# Altium project Board 2.PrjPcb
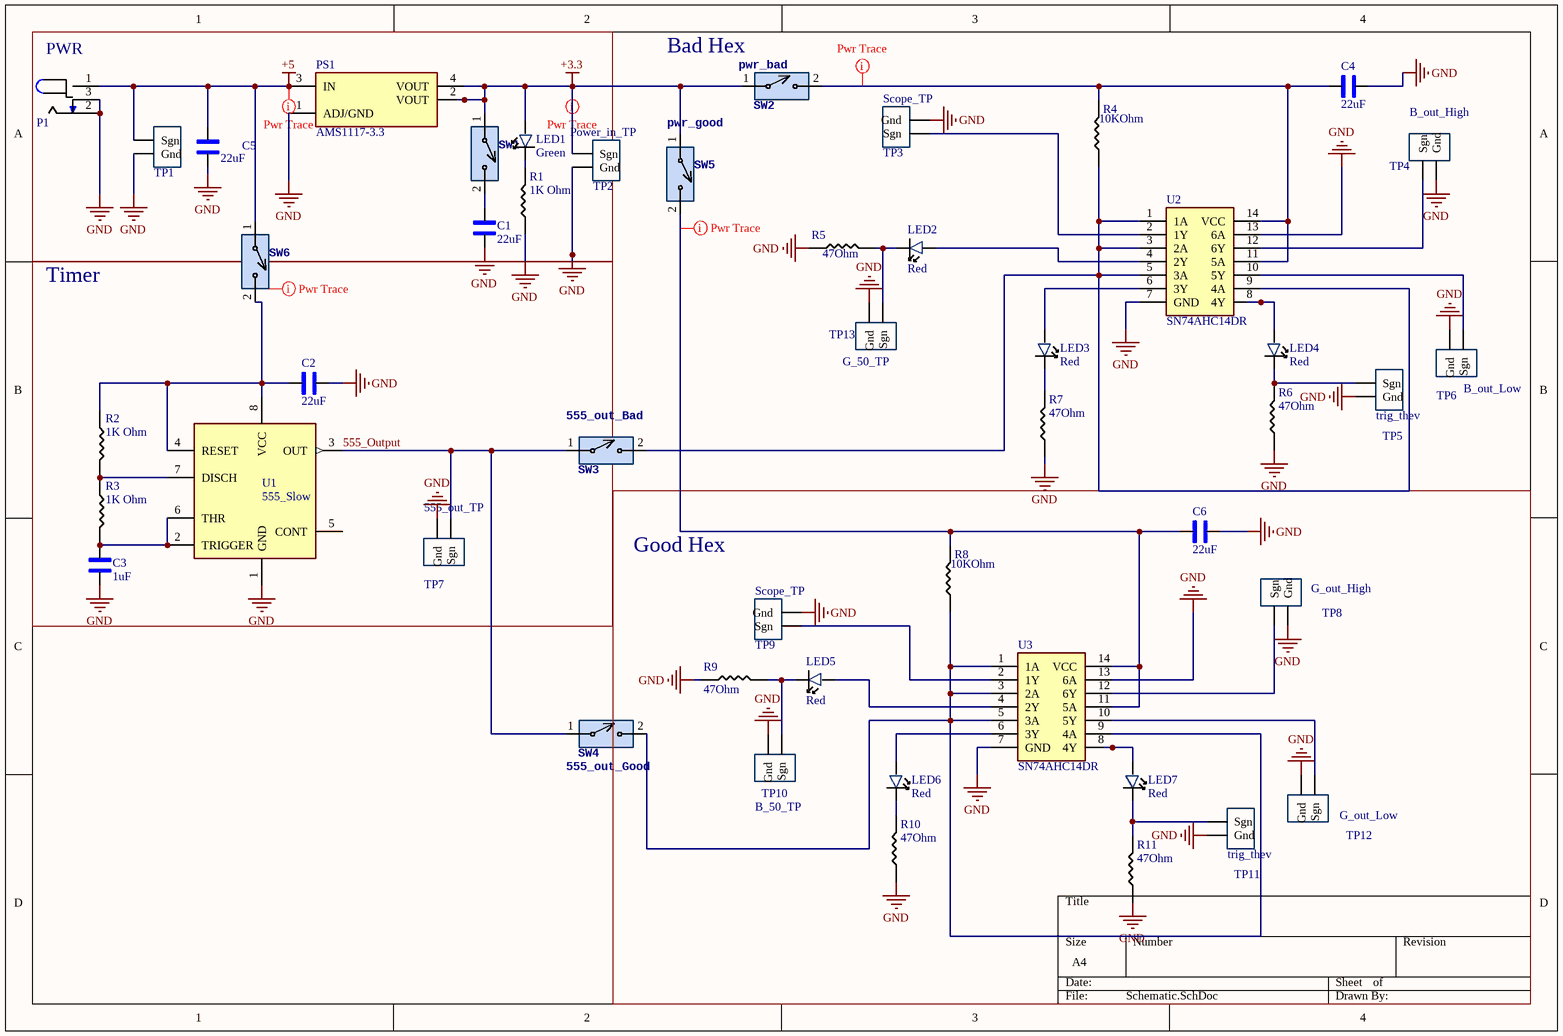
[diagram p0: Schematic.SchDoc]
1 sheet, 48 parts. Net scope: global (net labels, ports and power ports of the same name join across sheets).
Board file: PCB1.PcbDoc

## Sheet Schematic.SchDoc
size A4; SheetNumber: 1; SheetTotal: 1

### Parts
C1  22uF  [1206_Passive_Capacitor]
C2  22uF  [1206_Passive_Capacitor]
C3  1uF  [1206_Passive_Capacitor]
C4  22uF  [1206_Passive_Capacitor]
C5  22uF  [1206_Passive_Capacitor]
C6  22uF  [1206_Passive_Capacitor]
LED1  Green  [LED_1206]
LED2  Red  [LED_1206]
LED3  Red  [LED_1206]
LED4  Red  [LED_1206]
LED5  Red  [LED_1206]
LED6  Red  [LED_1206]
LED7  Red  [LED_1206]
P1  Power Jack  [Power_Jack]  (value not drawn)
PS1  AMS1117-3.3  [LDO]
R1  value 1K Ohm  [1206_Passive_Resitor]  (hidden comment: 1k)
R2  value 1K Ohm  [1206_Passive_Resitor]  (hidden comment: 1k)
R3  value 1K Ohm  [1206_Passive_Resitor]  (hidden comment: 1k)
R4  value 10KOhm  [1206_Passive_Resitor]  (hidden comment: 10k)
R5  value 47Ohm  [1206_Passive_Resitor]  (hidden comment: 47 Ohms)
R6  value 47Ohm  [1206_Passive_Resitor]  (hidden comment: 47 Ohms)
R7  value 47Ohm  [1206_Passive_Resitor]  (hidden comment: 47 Ohms)
R8  value 10KOhm  [1206_Passive_Resitor]  (hidden comment: 10k)
R9  value 47Ohm  [1206_Passive_Resitor]  (hidden comment: 47 Ohms)
R10  value 47Ohm  [1206_Passive_Resitor]  (hidden comment: 47 Ohms)
R11  value 47Ohm  [1206_Passive_Resitor]  (hidden comment: 47 Ohms)
SW1  SW_2Pin_100mil_Switch  [2Pin-Header-Conn]  (value not drawn)
SW2  pwr_bad  [2Pin-Header-Conn]
SW3  555_out_Bad  [2Pin-Header-Conn]
SW4  555_out_Good  [2Pin-Header-Conn]
SW5  pwr_good  [2Pin-Header-Conn]
SW6  Pwr_555_SW  [2Pin-Header-Conn]  (value not drawn)
TP1  Power_in_TP  [TP10x_Probe]  (value not drawn)
TP2  Power_in_TP  [TP10x_Probe]
TP3  Scope_TP  [TP10x_Probe]
TP4  B_out_High  [TP10x_Probe]
TP5  trig_thev  [TP10x_Probe]
TP6  B_out_Low  [TP10x_Probe]
TP7  555_out_TP  [TP10x_Probe]
TP8  G_out_High  [TP10x_Probe]
TP9  Scope_TP  [TP10x_Probe]
TP10  B_50_TP  [TP10x_Probe]
TP11  trig_thev  [TP10x_Probe]
TP12  G_out_Low  [TP10x_Probe]
TP13  G_50_TP  [TP10x_Probe]
U1  555_Slow  [TS555IDTTR]
U2  SN74AHC14DR  [HEX_74AC14]
U3  SN74AHC14DR  [HEX_74AC14]

### Blocks framed on the sheet
PWR: C1 C5 LED1 P1 PS1 R1 SW1 SW6 TP1 TP2
Timer: C2 C3 R2 R3 SW3 TP7 U1
Good Hex: C6 LED5-LED7 R8-R11 TP8-TP12 U3

### Nets
+3.3: LED1.1 PS1.2(VOUT) PS1.4(VOUT) SW1.1 SW2.1 SW5.1 TP2.1(Sgn)
+5: C5.2 P1.1 PS1.3(IN) SW6.1 TP1.1(Sgn)
GND: C1.1 C2.1 C3.2 C4.1 C5.1 C6.1 P1.2 P1.3 PS1.1(ADJ/GND) R1.1 R5.1 R6.1 R7.1 R9.1 R10.1 R11.1 TP1.2(Gnd) TP2.2(Gnd) TP3.2(Gnd) TP4.2(Gnd) TP5.2(Gnd) TP6.2(Gnd) TP7.2(Gnd) TP8.2(Gnd) TP9.2(Gnd) TP10.2(Gnd) TP11.2(Gnd) TP12.2(Gnd) TP13.2(Gnd) U1.1(GND) U2.7(GND) U2.13(6A) U3.7(GND) U3.13(6A)
555_Output: SW3.1 SW4.1 TP7.1(Sgn) U1.3(OUT)
NetC1_2: C1.2 SW1.2
NetC2_2: C2.2 R2.1 SW6.2 U1.4(RESET) U1.8(VCC)
NetC3_1: C3.1 R3.2 U1.2(TRIGGER) U1.6(THR)
NetC4_2: C4.2 R4.2 SW2.2 U2.11(5A) U2.14(VCC)
NetC6_2: C6.2 R8.2 SW5.2 U3.11(5A) U3.14(VCC)
NetLED1_2: LED1.2 R1.2
NetLED2_1: LED2.1 U2.4(2Y)
NetLED2_2: LED2.2 R5.2 TP13.1(Sgn)
NetLED3_1: LED3.1 U2.6(3Y)
NetLED3_2: LED3.2 R7.2
NetLED4_1: LED4.1 U2.8(4Y)
NetLED4_2: LED4.2 R6.2 TP5.1(Sgn)
NetLED5_1: LED5.1 U3.4(2Y)
NetLED5_2: LED5.2 R9.2 TP10.1(Sgn)
NetLED6_1: LED6.1 U3.6(3Y)
NetLED6_2: LED6.2 R10.2
NetLED7_1: LED7.1 U3.8(4Y)
NetLED7_2: LED7.2 R11.2 TP11.1(Sgn)
NetR2_2: R2.2 R3.1 U1.7(DISCH)
NetR4_1: R4.1 SW3.2 U2.1(1A) U2.3(2A) U2.5(3A) U2.9(4A)
NetR8_1: R8.1 SW4.2 U3.1(1A) U3.3(2A) U3.5(3A) U3.9(4A)
NetTP3_1: TP3.1(Sgn) U2.2(1Y)
NetTP4_1: TP4.1(Sgn) U2.12(6Y)
NetTP6_1: TP6.1(Sgn) U2.10(5Y)
NetTP8_1: TP8.1(Sgn) U3.12(6Y)
NetTP9_1: TP9.1(Sgn) U3.2(1Y)
NetTP12_1: TP12.1(Sgn) U3.10(5Y)

Not connected (* = marked no-connect by the designer): U1 5(CONT)

### Layout directives
rule Width Constraint [Pref Width = 20mil    Min Width = 10mil    Max Width = 100mil]: (no net found under the mark), +3.3, +5, NetC4_2, NetC6_2

### Notes on the sheet
- (near SW2) Bad Hex

### Library data of the parts
C1 C2 C4-C6 = C_22uF_1206: 22uF ±10% 25V X5R 1206 Multilayer Ceramic Capacitors MLCC - SMD/SMT RoHS; MFR Part #: CL31A226KAHNNNE; Type: basic; LCSC Part#: C12891; Datasheet: https://datasheet.lcsc.com/lcsc/1811031514_Samsung-Electro-Mechanics-CL31A226KAHNNNE_C12891.pdf; Value: 22uF
C3 = C_1uF_1206: MULTILAYER CERAMIC CAPACITORS MLCC - SMD/SMT 1UF 50V 1206 ROHS; MFR Part #: CL31B105KBHNNNE; Type: Basic; Digikey Link: https://www.digikey.com/product-detail/en/C1206C105M4RACTU/399-8150-1-ND/3471873/?itemSeq=304982366; LCSC Part#: C1848; Value: 1uF
LED1 = LED_GREEN_1206: Green 513~528nm 1206 Light Emitting Diodes (LED) RoHS; MFR Part #: SZYY1206G; Type: Extended; LCSC Part#: C434439; Datasheet: https://datasheet.lcsc.com/lcsc/2006301532_Yongyu-Photoelectric-SZYY1206G_C434439.pdf; Value: Green
LED2-LED7 = LED_RED_1206: Red 621~631nm 1206 Light Emitting Diodes (LED) RoHS; MFR Part #: 15-21/R6C-FQ1R1B/2T; Type: Extended; LCSC Part#: C93133; Datasheet: https://datasheet.lcsc.com/szlcsc/1811151241_Everlight-Elec-15-21-R6C-FQ1R1B-2T_C93133.pdf; Value: Red
P1 = P_Power Jack: Power Barrel Connector Jack 2.10mm ID (0.083"), 5.50mm OD (0.217") Through Hole, Right Angle; MFR Part #: PJ-102A; Value: CONN PWR JACK 2X5.5MM SOLDER; Digikey Link: https://www.digikey.com/product-detail/en/PJ-102A/CP-102A-ND/275425/?itemSeq=304982367; LCSC Part#: C136744; Type: Extended
PS1 = PS_AMS_LDO_3v3: LOW DROPOUT REGULATORS(LDO) POSITIVE FIXED 1.3V @ 800MA 15V 3.3V 1A SOT-223 ROHS; Value: IC REG LINEAR 3.3V 800MA SOT223; MFR Part #: AMS1117-3.3; LCSC Part#: C6186; Type: Basic
R1-R3 = R_1K_1206: CHIP RESISTOR - SURFACE MOUNT 1KOHMS ±1% 1/4W 1206 ROHS; MFR Part #: RNCP1206FTD1K00CT; Digikey Link: https://www.digikey.com/product-detail/en/RNCP1206FTD1K00/RNCP1206FTD1K00CT-ND/2240675/?itemSeq=304982373; LCSC Part#: C4410; Type: Basic
R4 R8 = R_10KOhm_1206: 10 kOhms ±5% 0.25W, 1/4W Chip Resistor 1206 (3216 Metric) Automotive AEC-Q200 Thick Film; MFR Part #: RMCF1206FT10K0; Digikey Link: https://www.digikey.com/en/products/detail/stackpole-electronics-inc/RMCF1206FT10K0/1759669; LCSC Part#: C17902; Type: Basic
R5-R7 R9-R11 = R_47Ohm_1206: 47Ω ±5% 0.25W ±200ppm/℃ 1206 Chip Resistor - Surface Mount RoHS; MFR Part #: 1206W4J0470T5E; LCSC Part#: C25384; Type: Extended; Datasheet: https://datasheet.lcsc.com/lcsc/1811101020_UNI-ROYAL-Uniroyal-Elec-1206W4J0470T5E_C25384.pdf
SW1-SW6 = SW_2Pin_100mil_Switch: 2Pin Header; LCSC Part#: C124375; Type: Extended
TP1-TP13 = TP_10x_Probe: Test Point 300 mil centers
U1 = U_555_Slow: 555 Timer SOIC-8_150MIL ROHS 150ns Rise Time; MFR Part #: NE555DR; Digikey Link: https://www.digikey.com/product-detail/en/texas-instruments/NE555DR/296-6501-1-ND/372490; Type: Basic; LCSC Part#: C7593
U2 U3 = U_74AHC14: Inverter IC 6 Channel Schmitt Trigger 14-SOIC; Datasheet: https://datasheet.lcsc.com/szlcsc/ON-Semicon-ON-74AC14SCX_C5482.pdf; MFR Part #: SN74AHC14DR; LCSC Part#: C6942; Type: Extended